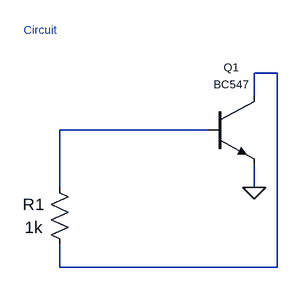
[diagram p0: schematic circuit.asc]
circuit.asc, the LTspice schematic file:
Version 4
SHEET 1 432 416
SYMBOL npn 448 336 R0
WINDOW 0 32 -40 Center 1
WINDOW 3 32 -16 Center 1
SYMATTR InstName Q1
SYMATTR Value BC547
SYMBOL res 224 448 R0
WINDOW 0 -20 40 Center 2
WINDOW 3 -20 72 Center 2
SYMATTR InstName R1
SYMATTR Value 1k
WIRE 240 384 240 464
WIRE 240 384 448 384
WIRE 240 544 240 576
WIRE 240 576 544 576
WIRE 512 304 512 336
WIRE 512 304 544 304
WIRE 512 432 512 464
WIRE 544 304 544 576
FLAG 512 464 0
TEXT 190 244 Left 1 ;Circuit

The netlist it stands for:
* circuit.asc
Q1 N002 N001 0 0 BC547
R1 N001 N002 1k
.model NPN NPN
.model PNP PNP
.lib standard.bjt
* Circuit
.backanno
.end